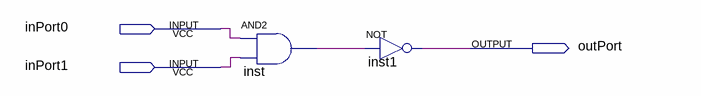
[diagram p0: schematic sheet]
// Quartus schematic GateDemo.bdf as structural Verilog: 2 symbols, 3 pins
module GateDemo (
  input  inPort0,
  input  inPort1,
  output outPort
);

  wire inst_out;

  and inst (inst_out, inPort0, inPort1);
  not inst1 (outPort, inst_out);
endmodule
